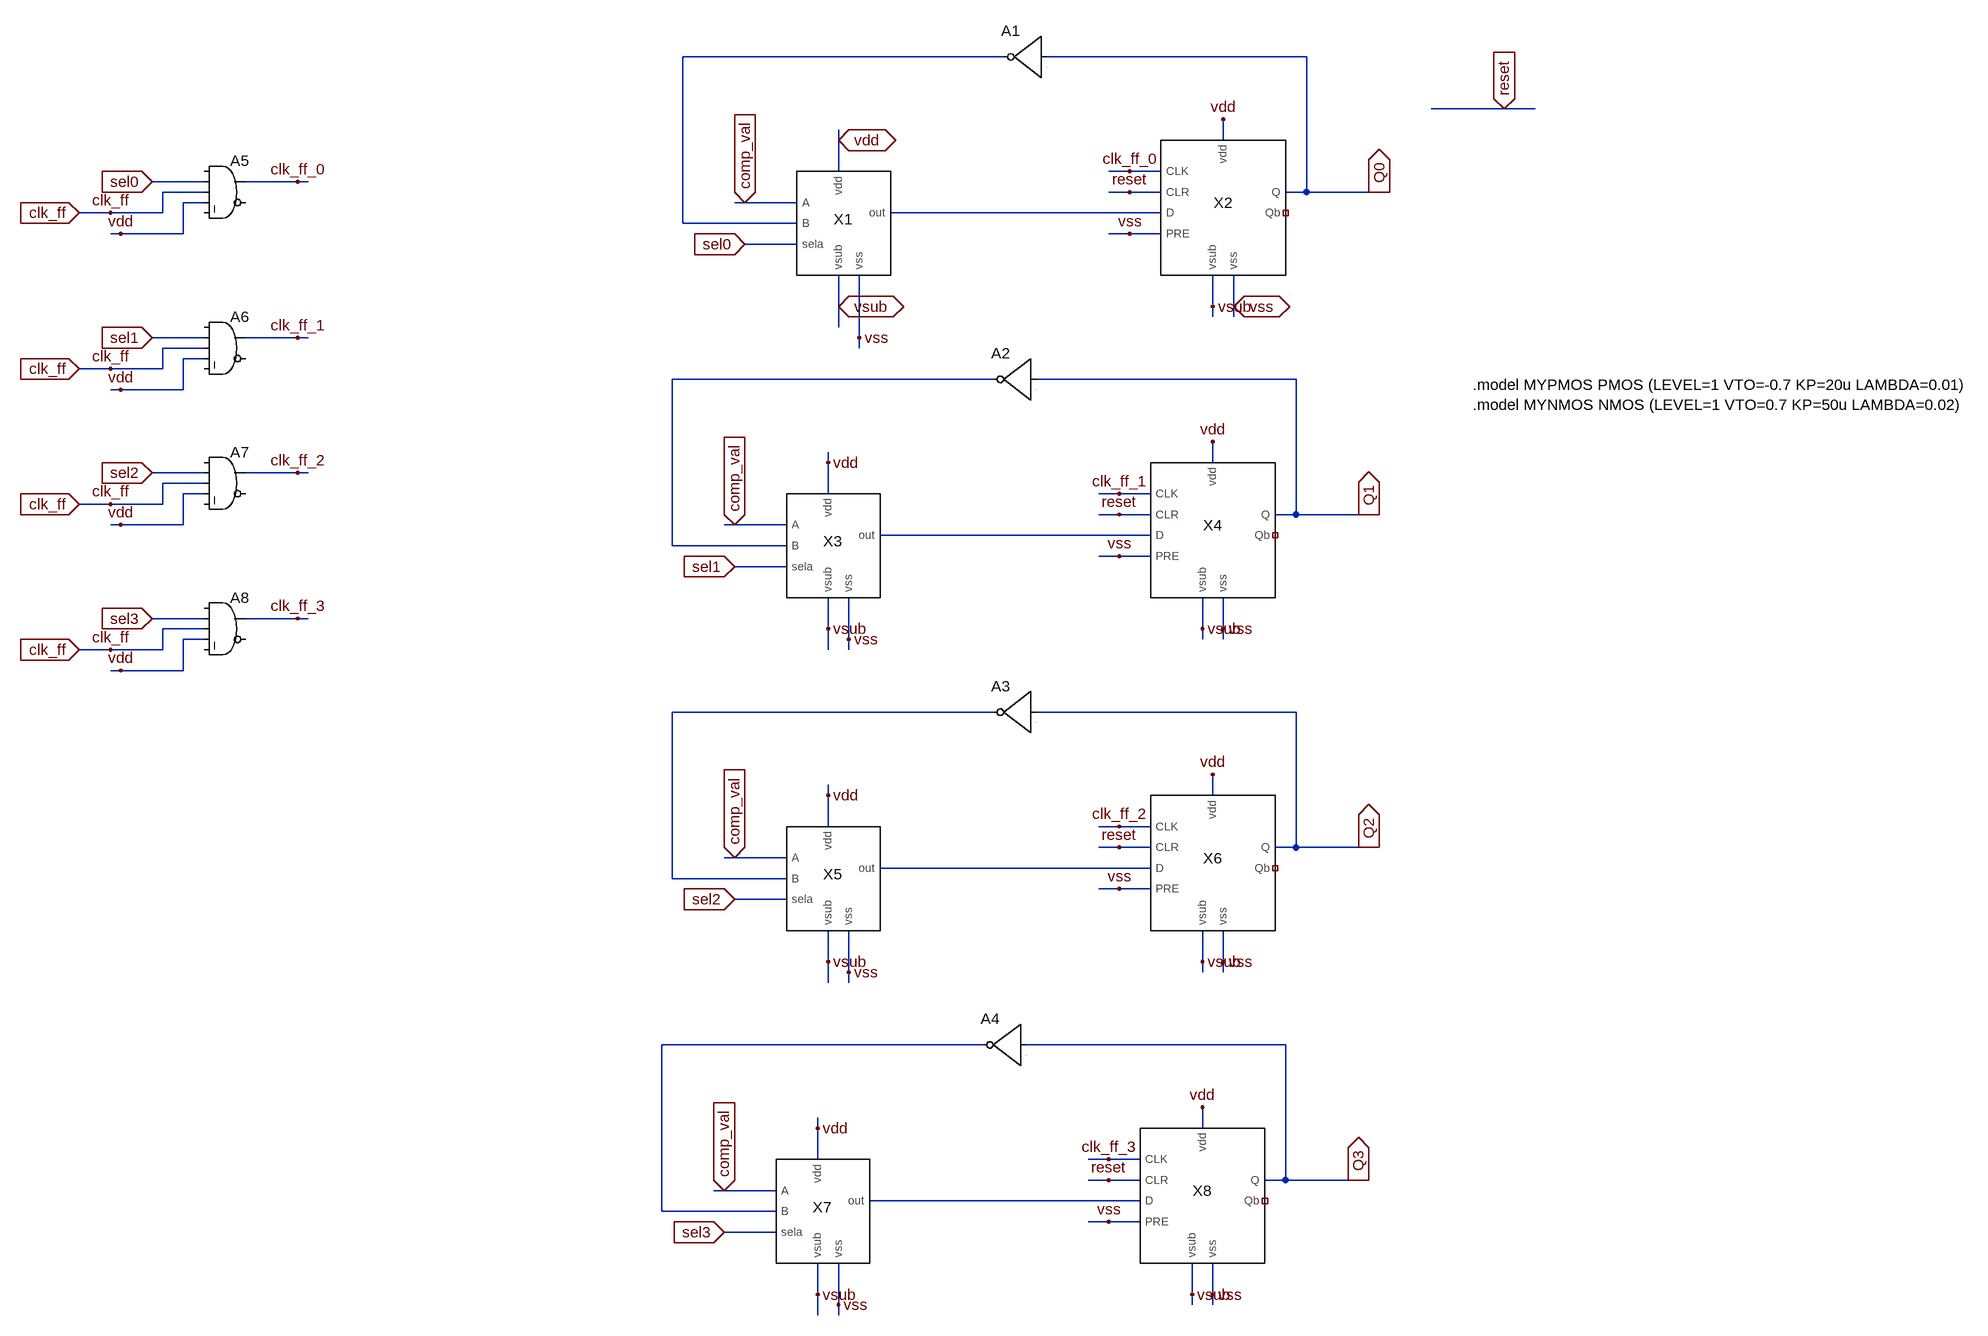
[diagram p0: schematic dsproj_SARlogicblock.asc]
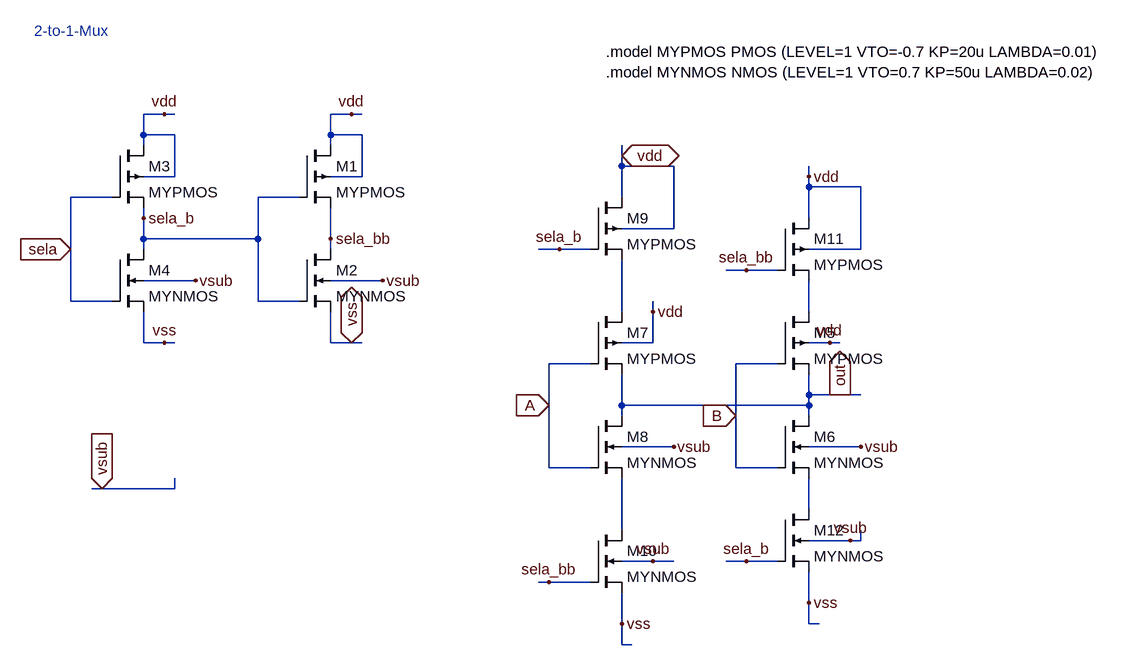
[diagram p1: sub-circuit dsproj_2to1mux.asc]
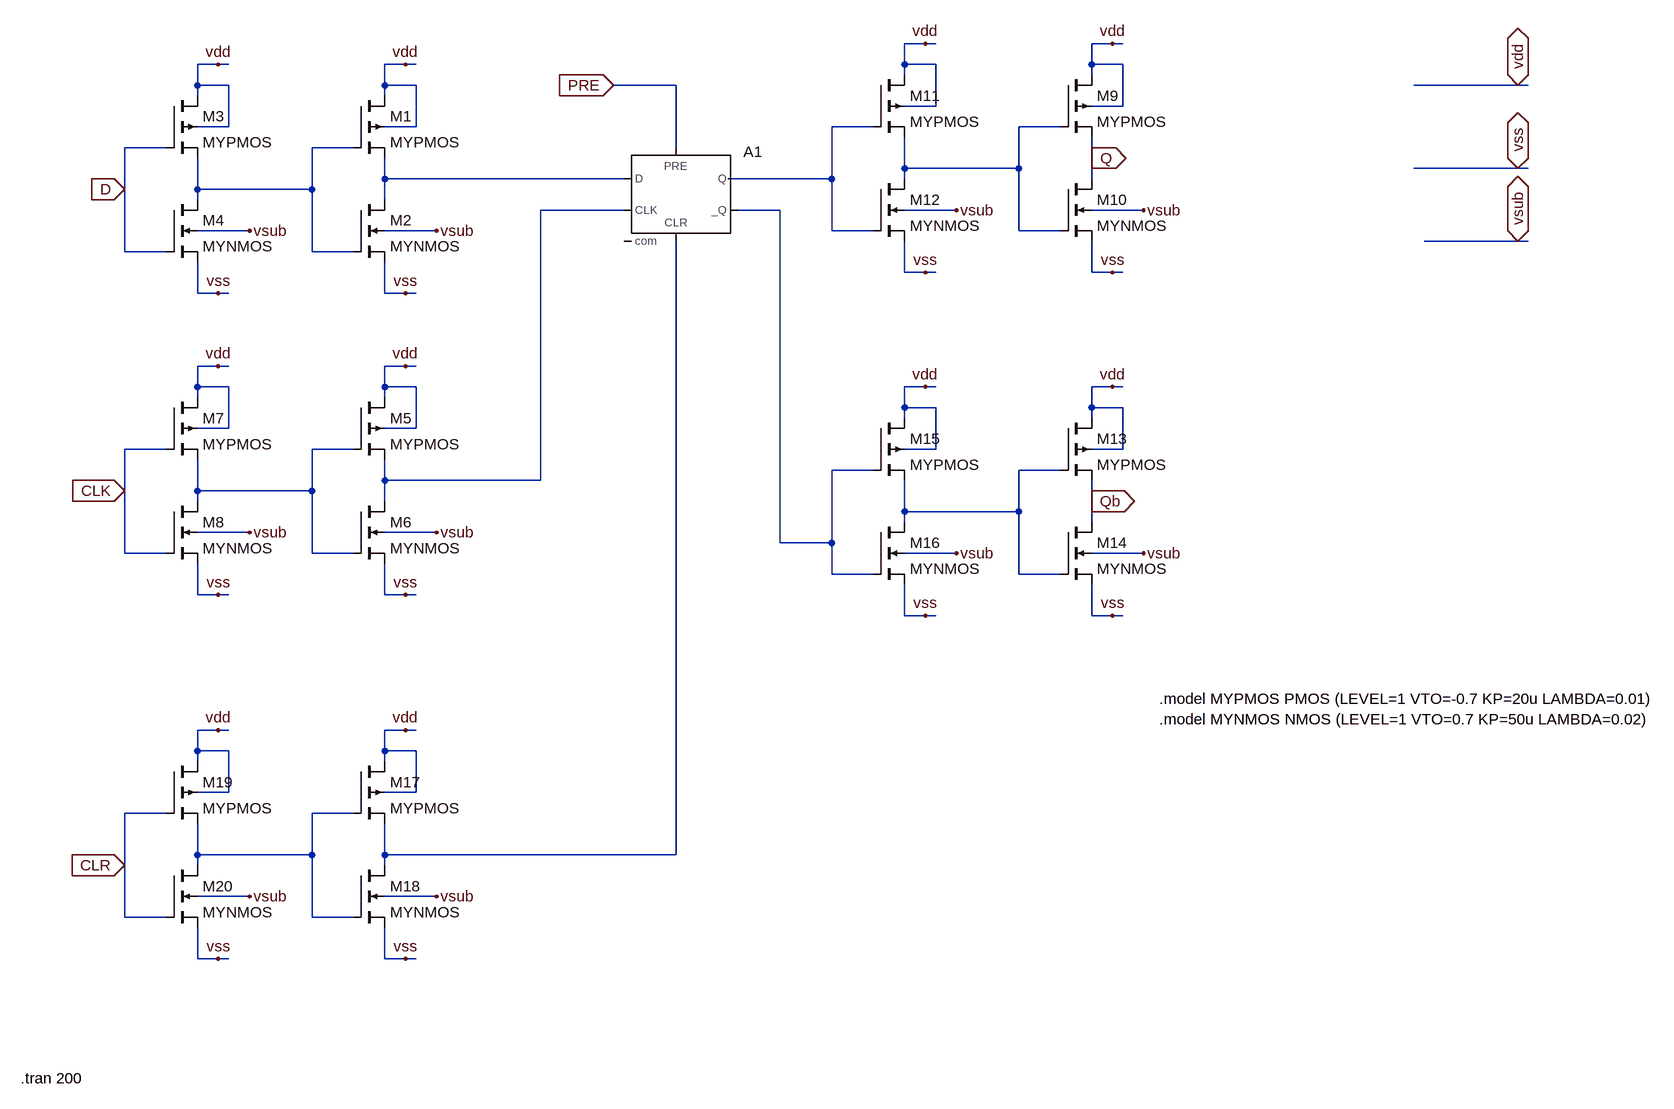
[diagram p2: sub-circuit dsproj_dff.asc]
dsproj_SARlogicblock.asc, the LTspice schematic file:
Version 4.1
SHEET 1 1944 1712
WIRE 432 -400 -64 -400
WIRE 896 -400 496 -400
WIRE 1200 -320 1088 -320
WIRE 1248 -320 1200 -320
WIRE 176 -272 176 -288
WIRE 768 -272 768 -304
WIRE 176 -224 176 -272
WIRE 624 -224 592 -224
WIRE 672 -224 624 -224
WIRE -800 -208 -880 -208
WIRE -656 -208 -736 -208
WIRE -640 -208 -656 -208
WIRE -800 -192 -864 -192
WIRE 624 -192 592 -192
WIRE 672 -192 624 -192
WIRE 896 -192 896 -400
WIRE 896 -192 864 -192
WIRE 1008 -192 896 -192
WIRE 1024 -192 1008 -192
WIRE -800 -176 -832 -176
WIRE 32 -176 16 -176
WIRE 112 -176 32 -176
WIRE -944 -160 -992 -160
WIRE -864 -160 -864 -192
WIRE -864 -160 -944 -160
WIRE 672 -160 256 -160
WIRE -64 -144 -64 -400
WIRE 112 -144 -64 -144
WIRE -928 -128 -944 -128
WIRE -832 -128 -832 -176
WIRE -832 -128 -928 -128
WIRE 624 -128 592 -128
WIRE 672 -128 624 -128
WIRE 112 -112 32 -112
WIRE 176 -16 176 -64
WIRE 752 -16 752 -64
WIRE 784 -16 784 -64
WIRE 752 0 752 -16
WIRE 784 0 784 -16
WIRE 176 16 176 -16
WIRE -800 32 -880 32
WIRE -656 32 -736 32
WIRE -640 32 -656 32
WIRE 208 32 208 -64
WIRE -800 48 -864 48
WIRE 208 48 208 32
WIRE -800 64 -832 64
WIRE -944 80 -992 80
WIRE -864 80 -864 48
WIRE -864 80 -944 80
WIRE 416 96 -80 96
WIRE 880 96 480 96
WIRE -928 112 -944 112
WIRE -832 112 -832 64
WIRE -832 112 -928 112
WIRE 160 224 160 208
WIRE 752 224 752 192
WIRE -800 240 -880 240
WIRE -656 240 -736 240
WIRE -640 240 -656 240
WIRE -800 256 -864 256
WIRE -800 272 -832 272
WIRE 160 272 160 224
WIRE 608 272 576 272
WIRE 656 272 608 272
WIRE -944 288 -992 288
WIRE -864 288 -864 256
WIRE -864 288 -944 288
WIRE 608 304 576 304
WIRE 656 304 608 304
WIRE 880 304 880 96
WIRE 880 304 848 304
WIRE 992 304 880 304
WIRE 1008 304 992 304
WIRE -928 320 -944 320
WIRE -832 320 -832 272
WIRE -832 320 -928 320
WIRE 16 320 0 320
WIRE 96 320 16 320
WIRE 656 336 240 336
WIRE -80 352 -80 96
WIRE 96 352 -80 352
WIRE 608 368 576 368
WIRE 656 368 608 368
WIRE 96 384 16 384
WIRE -800 464 -880 464
WIRE -656 464 -736 464
WIRE -640 464 -656 464
WIRE -800 480 -864 480
WIRE 160 480 160 432
WIRE 736 480 736 432
WIRE 768 480 768 432
WIRE -800 496 -832 496
WIRE 192 496 192 432
WIRE 736 496 736 480
WIRE 768 496 768 480
WIRE -944 512 -992 512
WIRE -864 512 -864 480
WIRE -864 512 -944 512
WIRE 160 512 160 480
WIRE 192 512 192 496
WIRE -928 544 -944 544
WIRE -832 544 -832 496
WIRE -832 544 -928 544
WIRE 416 608 -80 608
WIRE 880 608 480 608
WIRE 160 736 160 720
WIRE 752 736 752 704
WIRE 160 784 160 736
WIRE 608 784 576 784
WIRE 656 784 608 784
WIRE 608 816 576 816
WIRE 656 816 608 816
WIRE 880 816 880 608
WIRE 880 816 848 816
WIRE 992 816 880 816
WIRE 1008 816 992 816
WIRE 16 832 0 832
WIRE 96 832 16 832
WIRE 656 848 240 848
WIRE -80 864 -80 608
WIRE 96 864 -80 864
WIRE 608 880 576 880
WIRE 656 880 608 880
WIRE 96 896 16 896
WIRE 160 992 160 944
WIRE 736 992 736 944
WIRE 768 992 768 944
WIRE 192 1008 192 944
WIRE 736 1008 736 992
WIRE 768 1008 768 992
WIRE 160 1024 160 992
WIRE 192 1024 192 1008
WIRE 400 1120 -96 1120
WIRE 864 1120 464 1120
WIRE 144 1248 144 1232
WIRE 736 1248 736 1216
WIRE 144 1296 144 1248
WIRE 592 1296 560 1296
WIRE 640 1296 592 1296
WIRE 592 1328 560 1328
WIRE 640 1328 592 1328
WIRE 864 1328 864 1120
WIRE 864 1328 832 1328
WIRE 976 1328 864 1328
WIRE 992 1328 976 1328
WIRE 0 1344 -16 1344
WIRE 80 1344 0 1344
WIRE 640 1360 224 1360
WIRE -96 1376 -96 1120
WIRE 80 1376 -96 1376
WIRE 592 1392 560 1392
WIRE 640 1392 592 1392
WIRE 80 1408 0 1408
WIRE 144 1504 144 1456
WIRE 720 1504 720 1456
WIRE 752 1504 752 1456
WIRE 176 1520 176 1456
WIRE 720 1520 720 1504
WIRE 752 1520 752 1504
WIRE 144 1536 144 1504
WIRE 176 1536 176 1520
FLAG 784 -16 vss
IOPIN 784 -16 BiDir
FLAG 752 -16 vsub
FLAG 176 -272 vdd
IOPIN 176 -272 BiDir
FLAG 768 -304 vdd
FLAG 176 -16 vsub
IOPIN 176 -16 BiDir
FLAG 208 32 vss
FLAG 624 -128 vss
FLAG 624 -192 reset
FLAG 624 -224 clk_ff_0
FLAG 32 -176 comp_val
IOPIN 32 -176 In
FLAG 1008 -192 Q0
IOPIN 1008 -192 Out
FLAG 32 -112 sel0
IOPIN 32 -112 In
FLAG 768 480 vss
FLAG 736 480 vsub
FLAG 160 224 vdd
FLAG 752 192 vdd
FLAG 160 480 vsub
FLAG 192 496 vss
FLAG 608 368 vss
FLAG 608 304 reset
FLAG 608 272 clk_ff_1
FLAG 16 320 comp_val
IOPIN 16 320 In
FLAG 992 304 Q1
IOPIN 992 304 Out
FLAG 16 384 sel1
IOPIN 16 384 In
FLAG 768 992 vss
FLAG 736 992 vsub
FLAG 160 736 vdd
FLAG 752 704 vdd
FLAG 160 992 vsub
FLAG 192 1008 vss
FLAG 608 880 vss
FLAG 608 816 reset
FLAG 608 784 clk_ff_2
FLAG 16 832 comp_val
IOPIN 16 832 In
FLAG 992 816 Q2
IOPIN 992 816 Out
FLAG 16 896 sel2
IOPIN 16 896 In
FLAG 752 1504 vss
FLAG 720 1504 vsub
FLAG 144 1248 vdd
FLAG 736 1216 vdd
FLAG 144 1504 vsub
FLAG 176 1520 vss
FLAG 592 1392 vss
FLAG 592 1328 reset
FLAG 592 1296 clk_ff_3
FLAG 0 1344 comp_val
IOPIN 0 1344 In
FLAG 976 1328 Q3
IOPIN 976 1328 Out
FLAG 0 1408 sel3
IOPIN 0 1408 In
FLAG 1200 -320 reset
IOPIN 1200 -320 In
FLAG -880 -208 sel0
IOPIN -880 -208 In
FLAG -992 -160 clk_ff
IOPIN -992 -160 In
FLAG -928 -128 vdd
FLAG -656 -208 clk_ff_0
FLAG -944 -160 clk_ff
FLAG -880 32 sel1
IOPIN -880 32 In
FLAG -992 80 clk_ff
IOPIN -992 80 In
FLAG -928 112 vdd
FLAG -656 32 clk_ff_1
FLAG -944 80 clk_ff
FLAG -880 240 sel2
IOPIN -880 240 In
FLAG -992 288 clk_ff
IOPIN -992 288 In
FLAG -928 320 vdd
FLAG -656 240 clk_ff_2
FLAG -944 288 clk_ff
FLAG -880 464 sel3
IOPIN -880 464 In
FLAG -992 512 clk_ff
IOPIN -992 512 In
FLAG -928 544 vdd
FLAG -656 464 clk_ff_3
FLAG -944 512 clk_ff
SYMBOL dsproj_2to1mux 176 -144 R0
SYMATTR InstName X1
SYMBOL dsproj_dff 736 -160 R0
SYMATTR InstName X2
SYMBOL Digital\\inv 496 -464 M0
SYMATTR InstName A1
SYMBOL dsproj_2to1mux 160 352 R0
SYMATTR InstName X3
SYMBOL dsproj_dff 720 336 R0
SYMATTR InstName X4
SYMBOL Digital\\inv 480 32 M0
SYMATTR InstName A2
SYMBOL dsproj_2to1mux 160 864 R0
SYMATTR InstName X5
SYMBOL dsproj_dff 720 848 R0
SYMATTR InstName X6
SYMBOL Digital\\inv 480 544 M0
SYMATTR InstName A3
SYMBOL dsproj_2to1mux 144 1376 R0
SYMATTR InstName X7
SYMBOL dsproj_dff 704 1360 R0
SYMATTR InstName X8
SYMBOL Digital\\inv 464 1056 M0
SYMATTR InstName A4
SYMBOL Digital\\and -768 -256 R0
SYMATTR InstName A5
SYMBOL Digital\\and -768 -16 R0
SYMATTR InstName A6
SYMBOL Digital\\and -768 192 R0
SYMATTR InstName A7
SYMBOL Digital\\and -768 416 R0
SYMATTR InstName A8
TEXT 1152 104 Left 2 !.model MYPMOS PMOS (LEVEL=1 VTO=-0.7 KP=20u LAMBDA=0.01)\n.model MYNMOS NMOS (LEVEL=1 VTO=0.7 KP=50u LAMBDA=0.02)

dsproj_2to1mux.asc, the sub-circuit schematic file:
Version 4.1
SHEET 1 1264 680
WIRE -208 -432 -240 -432
WIRE -192 -432 -208 -432
WIRE 80 -432 48 -432
WIRE 96 -432 80 -432
WIRE -240 -400 -240 -432
WIRE -192 -400 -240 -400
WIRE 48 -400 48 -432
WIRE 96 -400 48 -400
WIRE -240 -384 -240 -400
WIRE 48 -384 48 -400
WIRE 496 -368 496 -384
WIRE 496 -352 496 -368
WIRE 576 -352 496 -352
WIRE -192 -336 -192 -400
WIRE -192 -336 -240 -336
WIRE 96 -336 96 -400
WIRE 96 -336 48 -336
WIRE 784 -336 784 -352
WIRE 784 -320 784 -336
WIRE 864 -320 784 -320
WIRE -288 -304 -352 -304
WIRE 0 -304 -64 -304
WIRE 496 -304 496 -352
WIRE -240 -272 -240 -288
WIRE 784 -272 784 -320
WIRE 576 -256 576 -352
WIRE 576 -256 496 -256
WIRE -240 -240 -240 -272
WIRE -64 -240 -64 -304
WIRE -64 -240 -240 -240
WIRE 48 -240 48 -288
WIRE -352 -224 -352 -304
WIRE -240 -224 -240 -240
WIRE 48 -224 48 -240
WIRE 400 -224 368 -224
WIRE 448 -224 400 -224
WIRE 864 -224 864 -320
WIRE 864 -224 784 -224
WIRE 688 -192 656 -192
WIRE 736 -192 688 -192
WIRE -160 -176 -240 -176
WIRE 128 -176 48 -176
WIRE -352 -144 -352 -224
WIRE -288 -144 -352 -144
WIRE -64 -144 -64 -240
WIRE 0 -144 -64 -144
WIRE 496 -128 496 -208
WIRE 544 -128 544 -144
WIRE 784 -128 784 -176
WIRE -240 -80 -240 -128
WIRE -208 -80 -240 -80
WIRE -192 -80 -208 -80
WIRE 48 -80 48 -128
WIRE 80 -80 48 -80
WIRE 96 -80 80 -80
WIRE 544 -80 544 -128
WIRE 544 -80 496 -80
WIRE 816 -80 784 -80
WIRE 832 -80 816 -80
WIRE 448 -48 384 -48
WIRE 736 -48 672 -48
WIRE 784 0 784 -32
WIRE 832 0 784 0
WIRE 864 0 832 0
WIRE 384 16 384 -48
WIRE 496 16 496 -32
WIRE 784 16 784 0
WIRE 784 16 496 16
WIRE 496 32 496 16
WIRE 672 32 672 -48
WIRE 784 32 784 16
WIRE 576 80 496 80
WIRE 864 80 784 80
WIRE 384 112 384 16
WIRE 448 112 384 112
WIRE 672 112 672 32
WIRE 736 112 672 112
WIRE -304 144 -320 144
WIRE -192 144 -192 128
WIRE -192 144 -304 144
WIRE 784 176 784 128
WIRE 496 208 496 128
WIRE 848 224 784 224
WIRE 864 224 864 208
WIRE 864 224 848 224
WIRE 544 256 496 256
WIRE 576 256 544 256
WIRE 688 256 656 256
WIRE 736 256 688 256
WIRE 384 288 368 288
WIRE 448 288 384 288
WIRE 784 320 784 272
WIRE 496 352 496 304
WIRE 784 352 784 320
WIRE 800 352 784 352
WIRE 496 384 496 352
WIRE 512 384 496 384
FLAG -208 -432 vdd
FLAG 80 -432 vdd
FLAG -208 -80 vss
FLAG 80 -80 vss
IOPIN 80 -80 BiDir
FLAG -160 -176 vsub
FLAG 128 -176 vsub
FLAG 576 80 vsub
FLAG 864 80 vsub
FLAG 384 16 A
IOPIN 384 16 In
FLAG -352 -224 sela
IOPIN -352 -224 In
FLAG -240 -272 sela_b
FLAG 48 -240 sela_bb
FLAG 400 -224 sela_b
FLAG 384 288 sela_bb
FLAG 496 -368 vdd
IOPIN 496 -368 BiDir
FLAG 496 352 vss
FLAG 544 -128 vdd
FLAG 816 -80 vdd
FLAG 544 256 vsub
FLAG 848 224 vsub
FLAG 784 320 vss
FLAG 688 -192 sela_bb
FLAG 688 256 sela_b
FLAG 672 32 B
IOPIN 672 32 In
FLAG 784 -336 vdd
FLAG 832 0 out
IOPIN 832 0 Out
FLAG -304 144 vsub
IOPIN -304 144 In
SYMBOL pmos4 0 -384 R0
SYMATTR InstName M1
SYMATTR Value MYPMOS
SYMATTR Value2 l=180e-9 w=2400e-9
SYMBOL nmos4 0 -224 R0
SYMATTR InstName M2
SYMATTR Value MYNMOS
SYMATTR Value2 l=180e-9 w=1200e-9
SYMBOL pmos4 -288 -384 R0
SYMATTR InstName M3
SYMATTR Value MYPMOS
SYMATTR Value2 l=180e-9 w=2400e-9
SYMBOL nmos4 -288 -224 R0
SYMATTR InstName M4
SYMATTR Value MYNMOS
SYMATTR Value2 l=180e-9 w=1200e-9
SYMBOL pmos4 736 -128 R0
SYMATTR InstName M5
SYMATTR Value MYPMOS
SYMATTR Value2 l=180e-9 w=2400e-9
SYMBOL nmos4 736 32 R0
SYMATTR InstName M6
SYMATTR Value MYNMOS
SYMATTR Value2 l=180e-9 w=1200e-9
SYMBOL pmos4 448 -128 R0
SYMATTR InstName M7
SYMATTR Value MYPMOS
SYMATTR Value2 l=180e-9 w=2400e-9
SYMBOL nmos4 448 32 R0
SYMATTR InstName M8
SYMATTR Value MYNMOS
SYMATTR Value2 l=180e-9 w=1200e-9
SYMBOL pmos4 448 -304 R0
SYMATTR InstName M9
SYMATTR Value MYPMOS
SYMATTR Value2 l=180e-9 w=2400e-9
SYMBOL nmos4 448 208 R0
SYMATTR InstName M10
SYMATTR Value MYNMOS
SYMATTR Value2 l=180e-9 w=1200e-9
SYMBOL pmos4 736 -272 R0
SYMATTR InstName M11
SYMATTR Value MYPMOS
SYMATTR Value2 l=180e-9 w=2400e-9
SYMBOL nmos4 736 176 R0
SYMATTR InstName M12
SYMATTR Value MYNMOS
SYMATTR Value2 l=180e-9 w=1200e-9
TEXT -408 -560 Left 2 ;2-to-1-Mux
TEXT 472 -528 Left 2 !.model MYPMOS PMOS (LEVEL=1 VTO=-0.7 KP=20u LAMBDA=0.01)\n.model MYNMOS NMOS (LEVEL=1 VTO=0.7 KP=50u LAMBDA=0.02)

dsproj_dff.asc, the sub-circuit schematic file:
Version 4.1
SHEET 1 1348 1480
WIRE 80 -128 48 -128
WIRE 96 -128 80 -128
WIRE 368 -128 336 -128
WIRE 384 -128 368 -128
WIRE -1008 -96 -1040 -96
WIRE -992 -96 -1008 -96
WIRE -720 -96 -752 -96
WIRE -704 -96 -720 -96
WIRE 48 -96 48 -128
WIRE 96 -96 48 -96
WIRE 336 -96 336 -128
WIRE 384 -96 336 -96
WIRE 48 -80 48 -96
WIRE 336 -80 336 -96
WIRE -1040 -64 -1040 -96
WIRE -992 -64 -1040 -64
WIRE -752 -64 -752 -96
WIRE -704 -64 -752 -64
WIRE -304 -64 -400 -64
WIRE 992 -64 832 -64
WIRE 1008 -64 992 -64
WIRE -1040 -48 -1040 -64
WIRE -752 -48 -752 -64
WIRE 96 -32 96 -96
WIRE 96 -32 48 -32
WIRE 384 -32 384 -96
WIRE 384 -32 336 -32
WIRE -992 0 -992 -64
WIRE -992 0 -1040 0
WIRE -704 0 -704 -64
WIRE -704 0 -752 0
WIRE 0 0 -64 0
WIRE 288 0 224 0
WIRE -1088 32 -1152 32
WIRE -800 32 -864 32
WIRE -304 32 -304 -64
WIRE 336 48 336 16
WIRE 48 64 48 16
WIRE 224 64 224 0
WIRE 224 64 48 64
WIRE 992 64 832 64
WIRE 1008 64 992 64
WIRE -752 80 -752 48
WIRE -384 80 -752 80
WIRE -64 80 -64 0
WIRE -64 80 -224 80
WIRE 48 80 48 64
WIRE 336 80 336 48
WIRE -1152 96 -1152 32
WIRE -1040 96 -1040 48
WIRE -864 96 -864 32
WIRE -864 96 -1040 96
WIRE -1040 112 -1040 96
WIRE -752 112 -752 80
WIRE -384 128 -512 128
WIRE -144 128 -208 128
WIRE 128 128 48 128
WIRE 416 128 336 128
WIRE -960 160 -1040 160
WIRE -672 160 -752 160
WIRE -64 160 -64 80
WIRE 0 160 -64 160
WIRE 224 160 224 64
WIRE 288 160 224 160
WIRE 992 176 848 176
WIRE 1008 176 992 176
WIRE -1152 192 -1152 96
WIRE -1088 192 -1152 192
WIRE -864 192 -864 96
WIRE -800 192 -864 192
WIRE 48 224 48 176
WIRE 80 224 48 224
WIRE 96 224 80 224
WIRE 336 224 336 176
WIRE 368 224 336 224
WIRE 384 224 368 224
WIRE -1040 256 -1040 208
WIRE -1008 256 -1040 256
WIRE -992 256 -1008 256
WIRE -752 256 -752 208
WIRE -720 256 -752 256
WIRE -704 256 -720 256
WIRE -1008 368 -1040 368
WIRE -992 368 -1008 368
WIRE -720 368 -752 368
WIRE -704 368 -720 368
WIRE -1040 400 -1040 368
WIRE -992 400 -1040 400
WIRE -752 400 -752 368
WIRE -704 400 -752 400
WIRE 80 400 48 400
WIRE 96 400 80 400
WIRE 368 400 336 400
WIRE 384 400 368 400
WIRE -1040 416 -1040 400
WIRE -752 416 -752 400
WIRE 48 432 48 400
WIRE 96 432 48 432
WIRE 336 432 336 400
WIRE 384 432 336 432
WIRE 48 448 48 432
WIRE 336 448 336 432
WIRE -992 464 -992 400
WIRE -992 464 -1040 464
WIRE -704 464 -704 400
WIRE -704 464 -752 464
WIRE -1088 496 -1152 496
WIRE -800 496 -864 496
WIRE 96 496 96 432
WIRE 96 496 48 496
WIRE 384 496 384 432
WIRE 384 496 336 496
WIRE 0 528 -64 528
WIRE 288 528 224 528
WIRE -752 544 -752 512
WIRE -512 544 -512 128
WIRE -512 544 -752 544
WIRE -1152 560 -1152 496
WIRE -1040 560 -1040 512
WIRE -864 560 -864 496
WIRE -864 560 -1040 560
WIRE -1040 576 -1040 560
WIRE -752 576 -752 544
WIRE 336 576 336 544
WIRE 48 592 48 544
WIRE 224 592 224 528
WIRE 224 592 48 592
WIRE 48 608 48 592
WIRE 336 608 336 576
WIRE -960 624 -1040 624
WIRE -672 624 -752 624
WIRE -144 640 -144 128
WIRE -64 640 -64 528
WIRE -64 640 -144 640
WIRE -1152 656 -1152 560
WIRE -1088 656 -1152 656
WIRE -864 656 -864 560
WIRE -800 656 -864 656
WIRE 128 656 48 656
WIRE 416 656 336 656
WIRE -64 688 -64 640
WIRE 0 688 -64 688
WIRE 224 688 224 592
WIRE 288 688 224 688
WIRE -1040 720 -1040 672
WIRE -1008 720 -1040 720
WIRE -992 720 -1008 720
WIRE -752 720 -752 672
WIRE -720 720 -752 720
WIRE -704 720 -720 720
WIRE 48 752 48 704
WIRE 80 752 48 752
WIRE 96 752 80 752
WIRE 336 752 336 704
WIRE 368 752 336 752
WIRE 384 752 368 752
WIRE -1008 928 -1040 928
WIRE -992 928 -1008 928
WIRE -720 928 -752 928
WIRE -704 928 -720 928
WIRE -1040 960 -1040 928
WIRE -992 960 -1040 960
WIRE -752 960 -752 928
WIRE -704 960 -752 960
WIRE -1040 976 -1040 960
WIRE -752 976 -752 960
WIRE -992 1024 -992 960
WIRE -992 1024 -1040 1024
WIRE -704 1024 -704 960
WIRE -704 1024 -752 1024
WIRE -1088 1056 -1152 1056
WIRE -800 1056 -864 1056
WIRE -1040 1120 -1040 1072
WIRE -864 1120 -864 1056
WIRE -864 1120 -1040 1120
WIRE -752 1120 -752 1072
WIRE -304 1120 -304 176
WIRE -304 1120 -752 1120
WIRE -1152 1136 -1152 1056
WIRE -1040 1136 -1040 1120
WIRE -752 1136 -752 1120
WIRE -960 1184 -1040 1184
WIRE -672 1184 -752 1184
WIRE -1152 1216 -1152 1136
WIRE -1088 1216 -1152 1216
WIRE -864 1216 -864 1120
WIRE -800 1216 -864 1216
WIRE -1040 1280 -1040 1232
WIRE -1008 1280 -1040 1280
WIRE -992 1280 -1008 1280
WIRE -752 1280 -752 1232
WIRE -720 1280 -752 1280
WIRE -704 1280 -720 1280
FLAG -1008 -96 vdd
FLAG -720 -96 vdd
FLAG -1008 256 vss
FLAG -720 256 vss
FLAG -960 160 vsub
FLAG -672 160 vsub
FLAG -1152 96 D
IOPIN -1152 96 In
FLAG -1008 368 vdd
FLAG -720 368 vdd
FLAG -1008 720 vss
FLAG -720 720 vss
FLAG -960 624 vsub
FLAG -672 624 vsub
FLAG -1152 560 CLK
IOPIN -1152 560 In
FLAG -400 -64 PRE
IOPIN -400 -64 In
FLAG 80 -128 vdd
FLAG 368 -128 vdd
FLAG 80 224 vss
FLAG 368 224 vss
FLAG 128 128 vsub
FLAG 416 128 vsub
FLAG 336 48 Q
IOPIN 336 48 Out
FLAG 80 400 vdd
FLAG 368 400 vdd
FLAG 80 752 vss
FLAG 368 752 vss
FLAG 128 656 vsub
FLAG 416 656 vsub
FLAG 336 576 Qb
IOPIN 336 576 Out
FLAG -1008 928 vdd
FLAG -720 928 vdd
FLAG -1008 1280 vss
FLAG -720 1280 vss
FLAG -960 1184 vsub
FLAG -672 1184 vsub
FLAG -1152 1136 CLR
IOPIN -1152 1136 In
FLAG 992 -64 vdd
IOPIN 992 -64 BiDir
FLAG 992 64 vss
IOPIN 992 64 BiDir
FLAG 992 176 vsub
IOPIN 992 176 BiDir
SYMBOL Digital\\dflop -304 32 R0
SYMATTR InstName A1
SYMBOL pmos4 -800 -48 R0
SYMATTR InstName M1
SYMATTR Value MYPMOS
SYMATTR Value2 l=180e-9 w=2400e-9
SYMBOL nmos4 -800 112 R0
SYMATTR InstName M2
SYMATTR Value MYNMOS
SYMATTR Value2 l=180e-9 w=1200e-9
SYMBOL pmos4 -1088 -48 R0
SYMATTR InstName M3
SYMATTR Value MYPMOS
SYMATTR Value2 l=180e-9 w=2400e-9
SYMBOL nmos4 -1088 112 R0
SYMATTR InstName M4
SYMATTR Value MYNMOS
SYMATTR Value2 l=180e-9 w=1200e-9
SYMBOL pmos4 -800 416 R0
SYMATTR InstName M5
SYMATTR Value MYPMOS
SYMATTR Value2 l=180e-9 w=2400e-9
SYMBOL nmos4 -800 576 R0
SYMATTR InstName M6
SYMATTR Value MYNMOS
SYMATTR Value2 l=180e-9 w=1200e-9
SYMBOL pmos4 -1088 416 R0
SYMATTR InstName M7
SYMATTR Value MYPMOS
SYMATTR Value2 l=180e-9 w=2400e-9
SYMBOL nmos4 -1088 576 R0
SYMATTR InstName M8
SYMATTR Value MYNMOS
SYMATTR Value2 l=180e-9 w=1200e-9
SYMBOL pmos4 288 -80 R0
SYMATTR InstName M9
SYMATTR Value MYPMOS
SYMATTR Value2 l=180e-9 w=2400e-9
SYMBOL nmos4 288 80 R0
SYMATTR InstName M10
SYMATTR Value MYNMOS
SYMATTR Value2 l=180e-9 w=1200e-9
SYMBOL pmos4 0 -80 R0
SYMATTR InstName M11
SYMATTR Value MYPMOS
SYMATTR Value2 l=180e-9 w=2400e-9
SYMBOL nmos4 0 80 R0
SYMATTR InstName M12
SYMATTR Value MYNMOS
SYMATTR Value2 l=180e-9 w=1200e-9
SYMBOL pmos4 288 448 R0
SYMATTR InstName M13
SYMATTR Value MYPMOS
SYMATTR Value2 l=180e-9 w=2400e-9
SYMBOL nmos4 288 608 R0
SYMATTR InstName M14
SYMATTR Value MYNMOS
SYMATTR Value2 l=180e-9 w=1200e-9
SYMBOL pmos4 0 448 R0
SYMATTR InstName M15
SYMATTR Value MYPMOS
SYMATTR Value2 l=180e-9 w=2400e-9
SYMBOL nmos4 0 608 R0
SYMATTR InstName M16
SYMATTR Value MYNMOS
SYMATTR Value2 l=180e-9 w=1200e-9
SYMBOL pmos4 -800 976 R0
SYMATTR InstName M17
SYMATTR Value MYPMOS
SYMATTR Value2 l=180e-9 w=2400e-9
SYMBOL nmos4 -800 1136 R0
SYMATTR InstName M18
SYMATTR Value MYNMOS
SYMATTR Value2 l=180e-9 w=1200e-9
SYMBOL pmos4 -1088 976 R0
SYMATTR InstName M19
SYMATTR Value MYPMOS
SYMATTR Value2 l=180e-9 w=2400e-9
SYMBOL nmos4 -1088 1136 R0
SYMATTR InstName M20
SYMATTR Value MYNMOS
SYMATTR Value2 l=180e-9 w=1200e-9
TEXT -1312 1464 Left 2 !.tran 200
TEXT 440 880 Left 2 !.model MYPMOS PMOS (LEVEL=1 VTO=-0.7 KP=20u LAMBDA=0.01)\n.model MYNMOS NMOS (LEVEL=1 VTO=0.7 KP=50u LAMBDA=0.02)

The netlist it stands for:
* dsproj_SARlogicblock.asc
X§X1 comp_val N001 sel0 vsub N002 vdd vss dsproj_2to1mux
X§X2 clk_ff_0 reset N002 vss Q0 NC_01 vdd vss vsub dsproj_dff
A1 Q0 0 0 0 0 N001 0 0 BUF
X§X3 comp_val N003 sel1 vsub N004 vdd vss dsproj_2to1mux
X§X4 clk_ff_1 reset N004 vss Q1 NC_02 vdd vss vsub dsproj_dff
A2 Q1 0 0 0 0 N003 0 0 BUF
X§X5 comp_val N005 sel2 vsub N006 vdd vss dsproj_2to1mux
X§X6 clk_ff_2 reset N006 vss Q2 NC_03 vdd vss vsub dsproj_dff
A3 Q2 0 0 0 0 N005 0 0 BUF
X§X7 comp_val N007 sel3 vsub N008 vdd vss dsproj_2to1mux
X§X8 clk_ff_3 reset N008 vss Q3 NC_04 vdd vss vsub dsproj_dff
A4 Q3 0 0 0 0 N007 0 0 BUF
A5 0 sel0 clk_ff vdd 0 0 clk_ff_0 0 AND
A6 0 sel1 clk_ff vdd 0 0 clk_ff_1 0 AND
A7 0 sel2 clk_ff vdd 0 0 clk_ff_2 0 AND
A8 0 sel3 clk_ff vdd 0 0 clk_ff_3 0 AND

* block symbol definitions
.subckt dsproj_2to1mux A B sela vsub out vdd vss
M1 vdd sela_b sela_bb vdd MYPMOS l=180e-9 w=2400e-9
M2 sela_bb sela_b vss vsub MYNMOS l=180e-9 w=1200e-9
M3 vdd sela sela_b vdd MYPMOS l=180e-9 w=2400e-9
M4 sela_b sela vss vsub MYNMOS l=180e-9 w=1200e-9
M5 N002 B out vdd MYPMOS l=180e-9 w=2400e-9
M6 out B N003 vsub MYNMOS l=180e-9 w=1200e-9
M7 N001 A out vdd MYPMOS l=180e-9 w=2400e-9
M8 out A N004 vsub MYNMOS l=180e-9 w=1200e-9
M9 vdd sela_b N001 vdd MYPMOS l=180e-9 w=2400e-9
M10 N004 sela_bb vss vsub MYNMOS l=180e-9 w=1200e-9
M11 vdd sela_bb N002 vdd MYPMOS l=180e-9 w=2400e-9
M12 N003 sela_b vss vsub MYNMOS l=180e-9 w=1200e-9
* 2-to-1-Mux
.model MYPMOS PMOS (LEVEL=1 VTO=-0.7 KP=20u LAMBDA=0.01)
.model MYNMOS NMOS (LEVEL=1 VTO=0.7 KP=50u LAMBDA=0.02)
.ends dsproj_2to1mux

.subckt dsproj_dff CLK CLR D PRE Q Qb vdd vss vsub
A1 N004 0 N005 PRE N010 N006 N001 0 DFLOP
M1 vdd N003 N004 vdd MYPMOS l=180e-9 w=2400e-9
M2 N004 N003 vss vsub MYNMOS l=180e-9 w=1200e-9
M3 vdd D N003 vdd MYPMOS l=180e-9 w=2400e-9
M4 N003 D vss vsub MYNMOS l=180e-9 w=1200e-9
M5 vdd N007 N005 vdd MYPMOS l=180e-9 w=2400e-9
M6 N005 N007 vss vsub MYNMOS l=180e-9 w=1200e-9
M7 vdd CLK N007 vdd MYPMOS l=180e-9 w=2400e-9
M8 N007 CLK vss vsub MYNMOS l=180e-9 w=1200e-9
M9 vdd N002 Q vdd MYPMOS l=180e-9 w=2400e-9
M10 Q N002 vss vsub MYNMOS l=180e-9 w=1200e-9
M11 vdd N001 N002 vdd MYPMOS l=180e-9 w=2400e-9
M12 N002 N001 vss vsub MYNMOS l=180e-9 w=1200e-9
M13 vdd N008 Qb vdd MYPMOS l=180e-9 w=2400e-9
M14 Qb N008 vss vsub MYNMOS l=180e-9 w=1200e-9
M15 vdd N006 N008 vdd MYPMOS l=180e-9 w=2400e-9
M16 N008 N006 vss vsub MYNMOS l=180e-9 w=1200e-9
M17 vdd N009 N010 vdd MYPMOS l=180e-9 w=2400e-9
M18 N010 N009 vss vsub MYNMOS l=180e-9 w=1200e-9
M19 vdd CLR N009 vdd MYPMOS l=180e-9 w=2400e-9
M20 N009 CLR vss vsub MYNMOS l=180e-9 w=1200e-9
.tran 200
.model MYPMOS PMOS (LEVEL=1 VTO=-0.7 KP=20u LAMBDA=0.01)
.model MYNMOS NMOS (LEVEL=1 VTO=0.7 KP=50u LAMBDA=0.02)
.ends dsproj_dff

.model NMOS NMOS
.model PMOS PMOS
.lib standard.mos
.model MYPMOS PMOS (LEVEL=1 VTO=-0.7 KP=20u LAMBDA=0.01)
.model MYNMOS NMOS (LEVEL=1 VTO=0.7 KP=50u LAMBDA=0.02)
.backanno
.end